# Altium schematic sheet buffered_leds.SchDoc
size A4
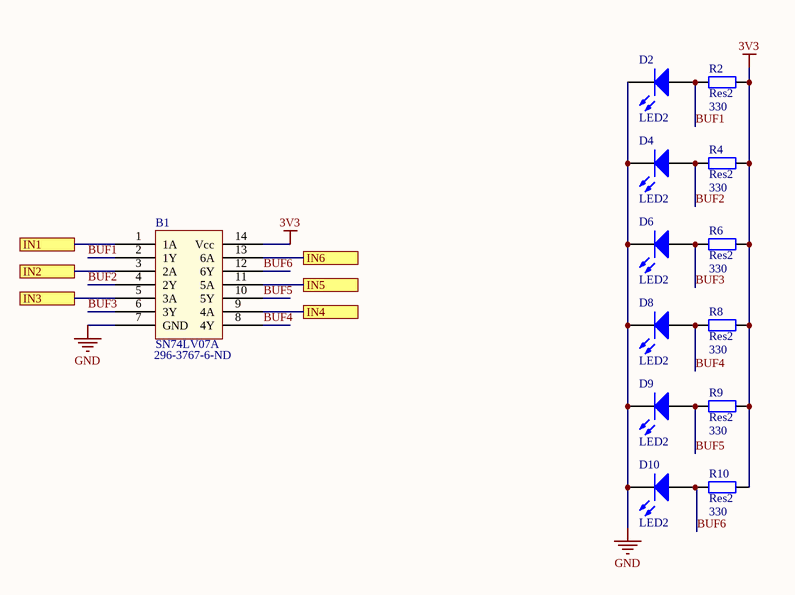
[diagram p0: buffered_leds.SchDoc]

## Parts
B1  SN74LV07A  Supplier Part Number 1: 296-3767-6-ND  [SOIC127P600X175-14N]
D2  LED2  [0603-LED]
D4  LED2  [0603-LED]
D6  LED2  [0603-LED]
D8  LED2  [0603-LED]
D9  LED2  [0603-LED]
D10  LED2  [0603-LED]
R2  Res2  value 330  [J1-0603]
R4  Res2  value 330  [J1-0603]
R6  Res2  value 330  [J1-0603]
R8  Res2  value 330  [J1-0603]
R9  Res2  value 330  [J1-0603]
R10  Res2  value 330  [J1-0603]

## Ports
IN1, IN2, IN3, IN4, IN5, IN6

## Nets
3V3: B1.14(Vcc) R2.1 R4.1 R6.1 R8.1 R9.1 R10.1
GND: B1.7(GND) D2.2(K) D4.2(K) D6.2(K) D8.2(K) D9.2(K) D10.2(K)
BUF1: B1.2(1Y) D2.1(A) R2.2
BUF2: B1.4(2Y) D4.1(A) R4.2
BUF3: B1.6(3Y) D6.1(A) R6.2
BUF4: B1.8(4Y) D8.1(A) R8.2
BUF5: B1.10(5Y) D9.1(A) R9.2
BUF6: B1.12(6Y) D10.1(A) R10.2
IN1: B1.1(1A) ; port IN1
IN2: B1.3(2A) ; port IN2
IN3: B1.5(3A) ; port IN3
IN4: B1.9(4A) ; port IN4
IN5: B1.11(5A) ; port IN5
IN6: B1.13(6A) ; port IN6

## Library data of the parts
D2 D4 D6 D8-D10 = LED2: Typical RED, GREEN, YELLOW, AMBER GaAs LED; Published: 8-Jun-2000; LatestRevisionDate: 17-Jul-2002; LatestRevisionNote: Re-released for DXP Platform.; PackageVersion: Feb-2002; PackageReference: 3.2X1.6X1.1; Publisher: Altium Limited; PackageDescription: SM LED; 2 Flat Leads
R2 R4 R6 R8-R10 = Res2: Resistor; Published: 8-Jun-2000; LatestRevisionDate: 17-Jul-2002; LatestRevisionNote: Re-released for DXP Platform.; PackageReference: AXIAL-0.4; Publisher: Altium Limited; PackageDescription: Axial Device, Thru-Hole; 2 Leads; 0.4 in Pin Spacing; Supplier 1: Digi-Key
B1 = SN74LV07A: Supplier 1: Digi-Key